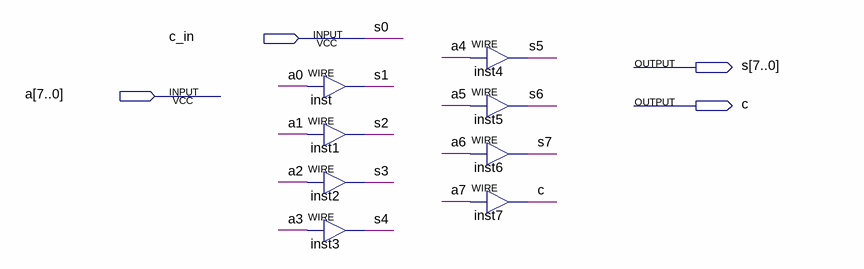
[diagram p0: schematic sheet]
// Quartus schematic rol.bdf as structural Verilog: 8 symbols, 4 pins
module rol (
  input  c_in,
  input  [7:0] a,
  output [7:0] s,
  output c
);

  assign s[1] = a[0];  // WIRE inst
  assign s[2] = a[1];  // WIRE inst1
  assign s[3] = a[2];  // WIRE inst2
  assign s[4] = a[3];  // WIRE inst3
  assign s[5] = a[4];  // WIRE inst4
  assign s[6] = a[5];  // WIRE inst5
  assign s[7] = a[6];  // WIRE inst6
  assign c = a[7];  // WIRE inst7

  assign s[0] = c_in;

  // Other names for the same wires on the sheet: s0 = c_in
endmodule
